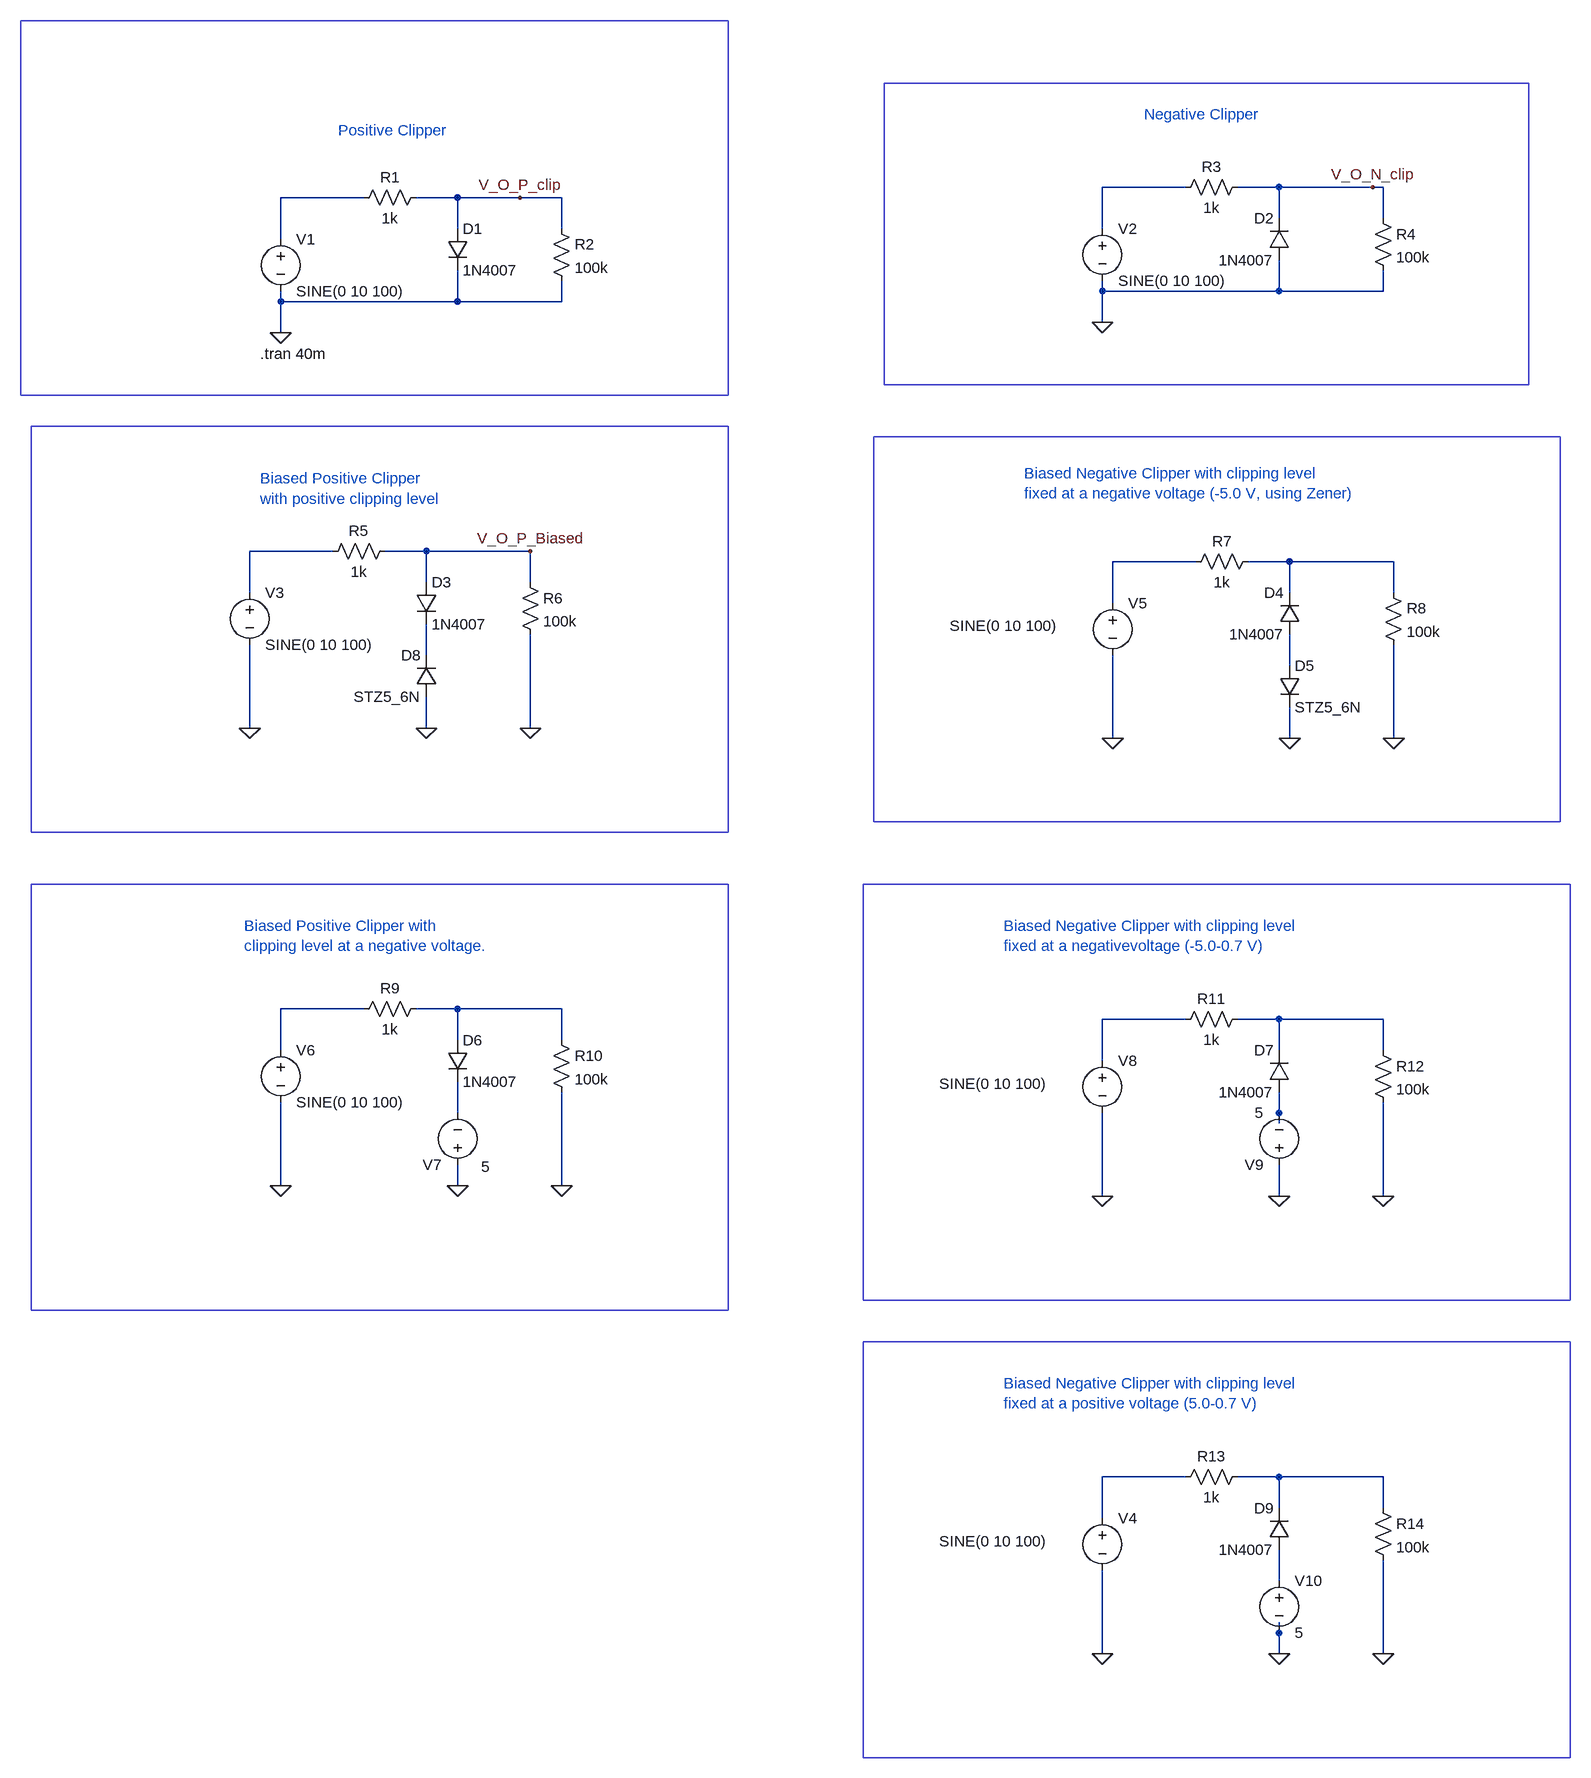
[diagram p0: schematic Demo_Clippers.asc]
Demo_Clippers.asc, the LTspice schematic file:
Version 4.1
SHEET 1 2596 2468
WIRE 1312 48 1184 48
WIRE 1456 48 1392 48
WIRE 1600 48 1456 48
WIRE 1616 48 1600 48
WIRE 48 64 -80 64
WIRE 192 64 128 64
WIRE 288 64 192 64
WIRE 352 64 288 64
WIRE 1456 96 1456 48
WIRE 1616 96 1616 48
WIRE 192 112 192 64
WIRE 352 112 352 64
WIRE 1184 112 1184 48
WIRE -80 128 -80 64
WIRE 1184 208 1184 192
WIRE 1456 208 1456 160
WIRE 1456 208 1184 208
WIRE 1616 208 1616 176
WIRE 1616 208 1456 208
WIRE -80 224 -80 208
WIRE 192 224 192 176
WIRE 192 224 -80 224
WIRE 352 224 352 192
WIRE 352 224 192 224
WIRE 1184 256 1184 208
WIRE -80 272 -80 224
WIRE 0 608 -128 608
WIRE 144 608 80 608
WIRE 304 608 144 608
WIRE 1328 624 1200 624
WIRE 1472 624 1408 624
WIRE 1632 624 1472 624
WIRE 144 656 144 608
WIRE 304 656 304 608
WIRE -128 672 -128 608
WIRE 1472 672 1472 624
WIRE 1632 672 1632 624
WIRE 1200 688 1200 624
WIRE 144 768 144 720
WIRE 1472 784 1472 736
WIRE -128 880 -128 752
WIRE 144 880 144 832
WIRE 304 880 304 736
WIRE 1200 896 1200 768
WIRE 1472 896 1472 848
WIRE 1632 896 1632 752
WIRE 48 1312 -80 1312
WIRE 192 1312 128 1312
WIRE 352 1312 192 1312
WIRE 1312 1328 1184 1328
WIRE 1456 1328 1392 1328
WIRE 1616 1328 1456 1328
WIRE 192 1360 192 1312
WIRE 352 1360 352 1312
WIRE -80 1376 -80 1312
WIRE 1456 1376 1456 1328
WIRE 1616 1376 1616 1328
WIRE 1184 1392 1184 1328
WIRE 192 1472 192 1424
WIRE 1456 1472 1456 1440
WIRE 1456 1488 1456 1472
WIRE -80 1584 -80 1456
WIRE 192 1584 192 1552
WIRE 352 1584 352 1440
WIRE 1184 1600 1184 1472
WIRE 1456 1600 1456 1552
WIRE 1616 1600 1616 1456
WIRE 1312 2032 1184 2032
WIRE 1456 2032 1392 2032
WIRE 1616 2032 1456 2032
WIRE 1456 2080 1456 2032
WIRE 1616 2080 1616 2032
WIRE 1184 2096 1184 2032
WIRE 1456 2192 1456 2144
WIRE 1456 2272 1456 2256
WIRE 1184 2304 1184 2176
WIRE 1456 2304 1456 2272
WIRE 1616 2304 1616 2160
FLAG -80 272 0
FLAG 1184 256 0
FLAG -128 880 0
FLAG 144 880 0
FLAG 304 880 0
FLAG 1200 896 0
FLAG 1472 896 0
FLAG 1632 896 0
FLAG -80 1584 0
FLAG 192 1584 0
FLAG 352 1584 0
FLAG 1184 1600 0
FLAG 1456 1600 0
FLAG 1616 1600 0
FLAG 288 64 V_O_P_clip
FLAG 1600 48 V_O_N_clip
FLAG 304 608 V_O_P_Biased
FLAG 1184 2304 0
FLAG 1456 2304 0
FLAG 1616 2304 0
SYMBOL diode 176 112 R0
SYMATTR InstName D1
SYMATTR Value 1N4007
SYMBOL res 32 80 R270
WINDOW 0 32 56 VTop 2
WINDOW 3 0 56 VBottom 2
SYMATTR InstName R1
SYMATTR Value 1k
SYMBOL res 336 96 R0
SYMATTR InstName R2
SYMATTR Value 100k
SYMBOL voltage -80 112 R0
WINDOW 123 0 0 Left 0
WINDOW 39 0 0 Left 0
SYMATTR InstName V1
SYMATTR Value SINE(0 10 100)
SYMBOL diode 1472 160 R180
WINDOW 0 24 64 Left 2
WINDOW 3 24 0 Left 2
SYMATTR InstName D2
SYMATTR Value 1N4007
SYMBOL res 1296 64 R270
WINDOW 0 32 56 VTop 2
WINDOW 3 0 56 VBottom 2
SYMATTR InstName R3
SYMATTR Value 1k
SYMBOL res 1600 80 R0
SYMATTR InstName R4
SYMATTR Value 100k
SYMBOL voltage 1184 96 R0
WINDOW 123 0 0 Left 0
WINDOW 39 0 0 Left 0
SYMATTR InstName V2
SYMATTR Value SINE(0 10 100)
SYMBOL diode 128 656 R0
SYMATTR InstName D3
SYMATTR Value 1N4007
SYMBOL res -16 624 R270
WINDOW 0 32 56 VTop 2
WINDOW 3 0 56 VBottom 2
SYMATTR InstName R5
SYMATTR Value 1k
SYMBOL res 288 640 R0
SYMATTR InstName R6
SYMATTR Value 100k
SYMBOL voltage -128 656 R0
WINDOW 123 0 0 Left 0
WINDOW 39 0 0 Left 0
SYMATTR InstName V3
SYMATTR Value SINE(0 10 100)
SYMBOL diode 1488 736 R180
WINDOW 0 24 64 Left 2
WINDOW 3 24 0 Left 2
SYMATTR InstName D4
SYMATTR Value 1N4007
SYMBOL res 1312 640 R270
WINDOW 0 32 56 VTop 2
WINDOW 3 0 56 VBottom 2
SYMATTR InstName R7
SYMATTR Value 1k
SYMBOL res 1616 656 R0
SYMATTR InstName R8
SYMATTR Value 100k
SYMBOL voltage 1200 672 R0
WINDOW 3 -251 51 Left 2
WINDOW 123 0 0 Left 0
WINDOW 39 0 0 Left 0
SYMATTR Value SINE(0 10 100)
SYMATTR InstName V5
SYMBOL diode 1456 784 R0
SYMATTR InstName D5
SYMATTR Value STZ5_6N
SYMBOL diode 176 1360 R0
SYMATTR InstName D6
SYMATTR Value 1N4007
SYMBOL res 32 1328 R270
WINDOW 0 32 56 VTop 2
WINDOW 3 0 56 VBottom 2
SYMATTR InstName R9
SYMATTR Value 1k
SYMBOL res 336 1344 R0
SYMATTR InstName R10
SYMATTR Value 100k
SYMBOL voltage -80 1360 R0
WINDOW 123 0 0 Left 0
WINDOW 39 0 0 Left 0
SYMATTR InstName V6
SYMATTR Value SINE(0 10 100)
SYMBOL voltage 192 1568 R180
WINDOW 3 -50 13 Left 2
WINDOW 123 0 0 Left 0
WINDOW 39 0 0 Left 0
SYMATTR Value 5
SYMATTR InstName V7
SYMBOL diode 1472 1440 R180
WINDOW 0 24 64 Left 2
WINDOW 3 24 0 Left 2
SYMATTR InstName D7
SYMATTR Value 1N4007
SYMBOL res 1296 1344 R270
WINDOW 0 32 56 VTop 2
WINDOW 3 0 56 VBottom 2
SYMATTR InstName R11
SYMATTR Value 1k
SYMBOL res 1600 1360 R0
SYMATTR InstName R12
SYMATTR Value 100k
SYMBOL voltage 1184 1376 R0
WINDOW 3 -251 51 Left 2
WINDOW 123 0 0 Left 0
WINDOW 39 0 0 Left 0
SYMATTR Value SINE(0 10 100)
SYMATTR InstName V8
SYMBOL voltage 1456 1568 R180
WINDOW 123 0 0 Left 0
WINDOW 39 0 0 Left 0
SYMATTR InstName V9
SYMATTR Value 5
SYMBOL diode 160 832 R180
WINDOW 0 24 64 Left 2
WINDOW 3 24 0 Left 2
SYMATTR InstName D8
SYMATTR Value STZ5_6N
SYMBOL diode 1472 2144 R180
WINDOW 0 24 64 Left 2
WINDOW 3 24 0 Left 2
SYMATTR InstName D9
SYMATTR Value 1N4007
SYMBOL res 1296 2048 R270
WINDOW 0 32 56 VTop 2
WINDOW 3 0 56 VBottom 2
SYMATTR InstName R13
SYMATTR Value 1k
SYMBOL res 1600 2064 R0
SYMATTR InstName R14
SYMATTR Value 100k
SYMBOL voltage 1184 2080 R0
WINDOW 3 -251 51 Left 2
WINDOW 123 0 0 Left 0
WINDOW 39 0 0 Left 0
SYMATTR Value SINE(0 10 100)
SYMATTR InstName V4
SYMBOL voltage 1456 2176 R0
WINDOW 123 0 0 Left 0
WINDOW 39 0 0 Left 0
SYMATTR InstName V10
SYMATTR Value 5
TEXT -112 304 Left 2 !.tran 40m
TEXT 8 -40 Left 2 ;Positive Clipper
TEXT 1248 -64 Left 2 ;Negative Clipper
TEXT -112 496 Left 2 ;Biased Positive Clipper\nwith positive clipping level
TEXT 1064 488 Left 2 ;Biased Negative Clipper with clipping level\nfixed at a negative voltage (-5.0 V, using Zener)
TEXT -136 1184 Left 2 ;Biased Positive Clipper with\nclipping level at a negative voltage.
TEXT 1032 1184 Left 2 ;Biased Negative Clipper with clipping level\nfixed at a negativevoltage (-5.0-0.7 V)
TEXT 1032 1888 Left 2 ;Biased Negative Clipper with clipping level\nfixed at a positive voltage (5.0-0.7 V)
RECTANGLE Normal 1840 352 848 -112
RECTANGLE Normal 1888 1024 832 432
RECTANGLE Normal 1904 1760 816 1120
RECTANGLE Normal 608 1776 -464 1120
RECTANGLE Normal 608 1040 -464 416
RECTANGLE Normal 608 368 -480 -208
RECTANGLE Normal 1904 2464 816 1824

The netlist it stands for:
* Demo_Clippers.asc
D1 V_O_P_clip 0 1N4007
R1 N002 V_O_P_clip 1k
R2 V_O_P_clip 0 100k
V1 N002 0 SINE(0 10 100)
D2 0 V_O_N_clip 1N4007
R3 N001 V_O_N_clip 1k
R4 V_O_N_clip 0 100k
V2 N001 0 SINE(0 10 100)
D3 V_O_P_Biased N006 1N4007
R5 N003 V_O_P_Biased 1k
R6 V_O_P_Biased 0 100k
V3 N003 0 SINE(0 10 100)
D4 N007 N005 1N4007
R7 N004 N005 1k
R8 N005 0 100k
V5 N004 0 SINE(0 10 100)
D5 N007 0 STZ5_6N
D6 N009 N012 1N4007
R9 N008 N009 1k
R10 N009 0 100k
V6 N008 0 SINE(0 10 100)
V7 0 N012 5
D7 N013 N011 1N4007
R11 N010 N011 1k
R12 N011 0 100k
V8 N010 0 SINE(0 10 100)
V9 0 N013 5
D8 0 N006 STZ5_6N
D9 N016 N015 1N4007
R13 N014 N015 1k
R14 N015 0 100k
V4 N014 0 SINE(0 10 100)
V10 N016 0 5
.model D D
.lib standard.dio
.tran 40m
* Positive Clipper
* Negative Clipper
* Biased Positive Clipper
* with positive clipping level
* Biased Negative Clipper with clipping level
* fixed at a negative voltage (-5.0 V, using Zener)
* Biased Positive Clipper with
* clipping level at a negative voltage.
* Biased Negative Clipper with clipping level
* fixed at a negativevoltage (-5.0-0.7 V)
* Biased Negative Clipper with clipping level
* fixed at a positive voltage (5.0-0.7 V)
.backanno
.end